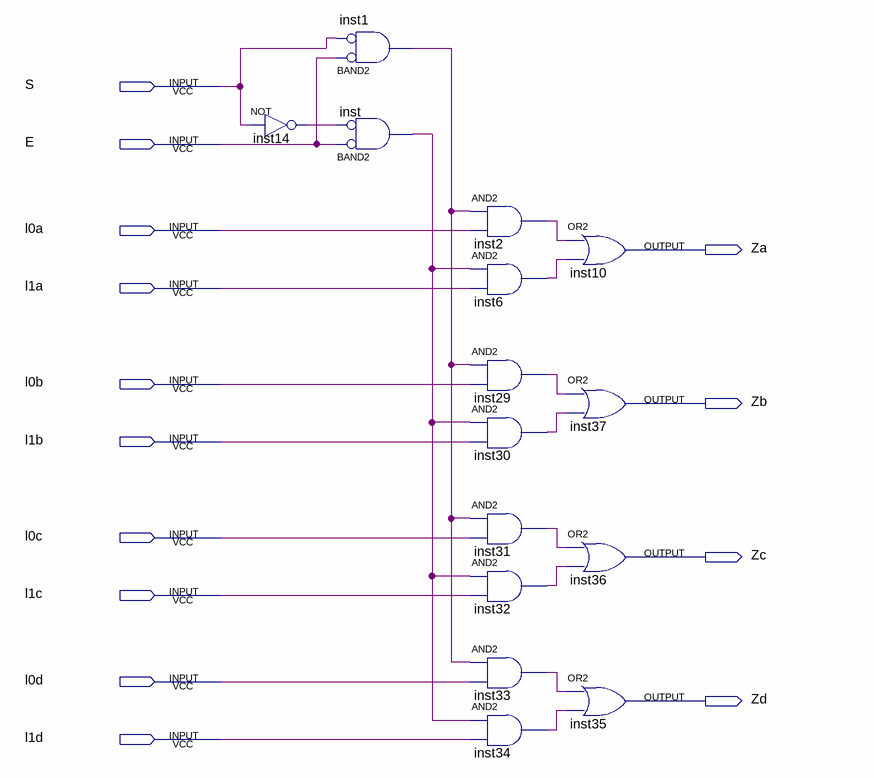
[diagram p0: schematic sheet]
// Quartus schematic ci_74LS157.bdf as structural Verilog: 15 symbols, 14 pins
module ci_74LS157 (
  input  S,
  input  E,
  input  l0a,
  input  l1a,
  input  l0b,
  input  l1b,
  input  l0c,
  input  l1c,
  input  l0d,
  input  l1d,
  output Za,
  output Zb,
  output Zc,
  output Zd
);

  wire inst1_out, inst2_out, inst6_out, inst14_out, inst29_out, inst30_out, inst31_out, inst32_out,
       inst33_out, inst34_out, inst_out;

  not inst14 (inst14_out, S);
  and inst1 (inst1_out, ~E, ~S);  // BAND2
  and inst (inst_out, ~E, ~inst14_out);  // BAND2
  and inst2 (inst2_out, inst1_out, l0a);
  and inst6 (inst6_out, inst_out, l1a);
  and inst29 (inst29_out, inst1_out, l0b);
  and inst30 (inst30_out, inst_out, l1b);
  and inst31 (inst31_out, inst1_out, l0c);
  and inst32 (inst32_out, inst_out, l1c);
  and inst33 (inst33_out, inst1_out, l0d);
  and inst34 (inst34_out, inst_out, l1d);
  or inst10 (Za, inst2_out, inst6_out);
  or inst37 (Zb, inst29_out, inst30_out);
  or inst36 (Zc, inst31_out, inst32_out);
  or inst35 (Zd, inst33_out, inst34_out);
endmodule
